# EasyEDA schematic SCH_XO-PAD_2026-07-20.json
TITLE: Sheet_1; REV: 1.0; Date: 2026-07-19; Sheet: 1/1; Drawn By: zumikoboi; Company: Your Company
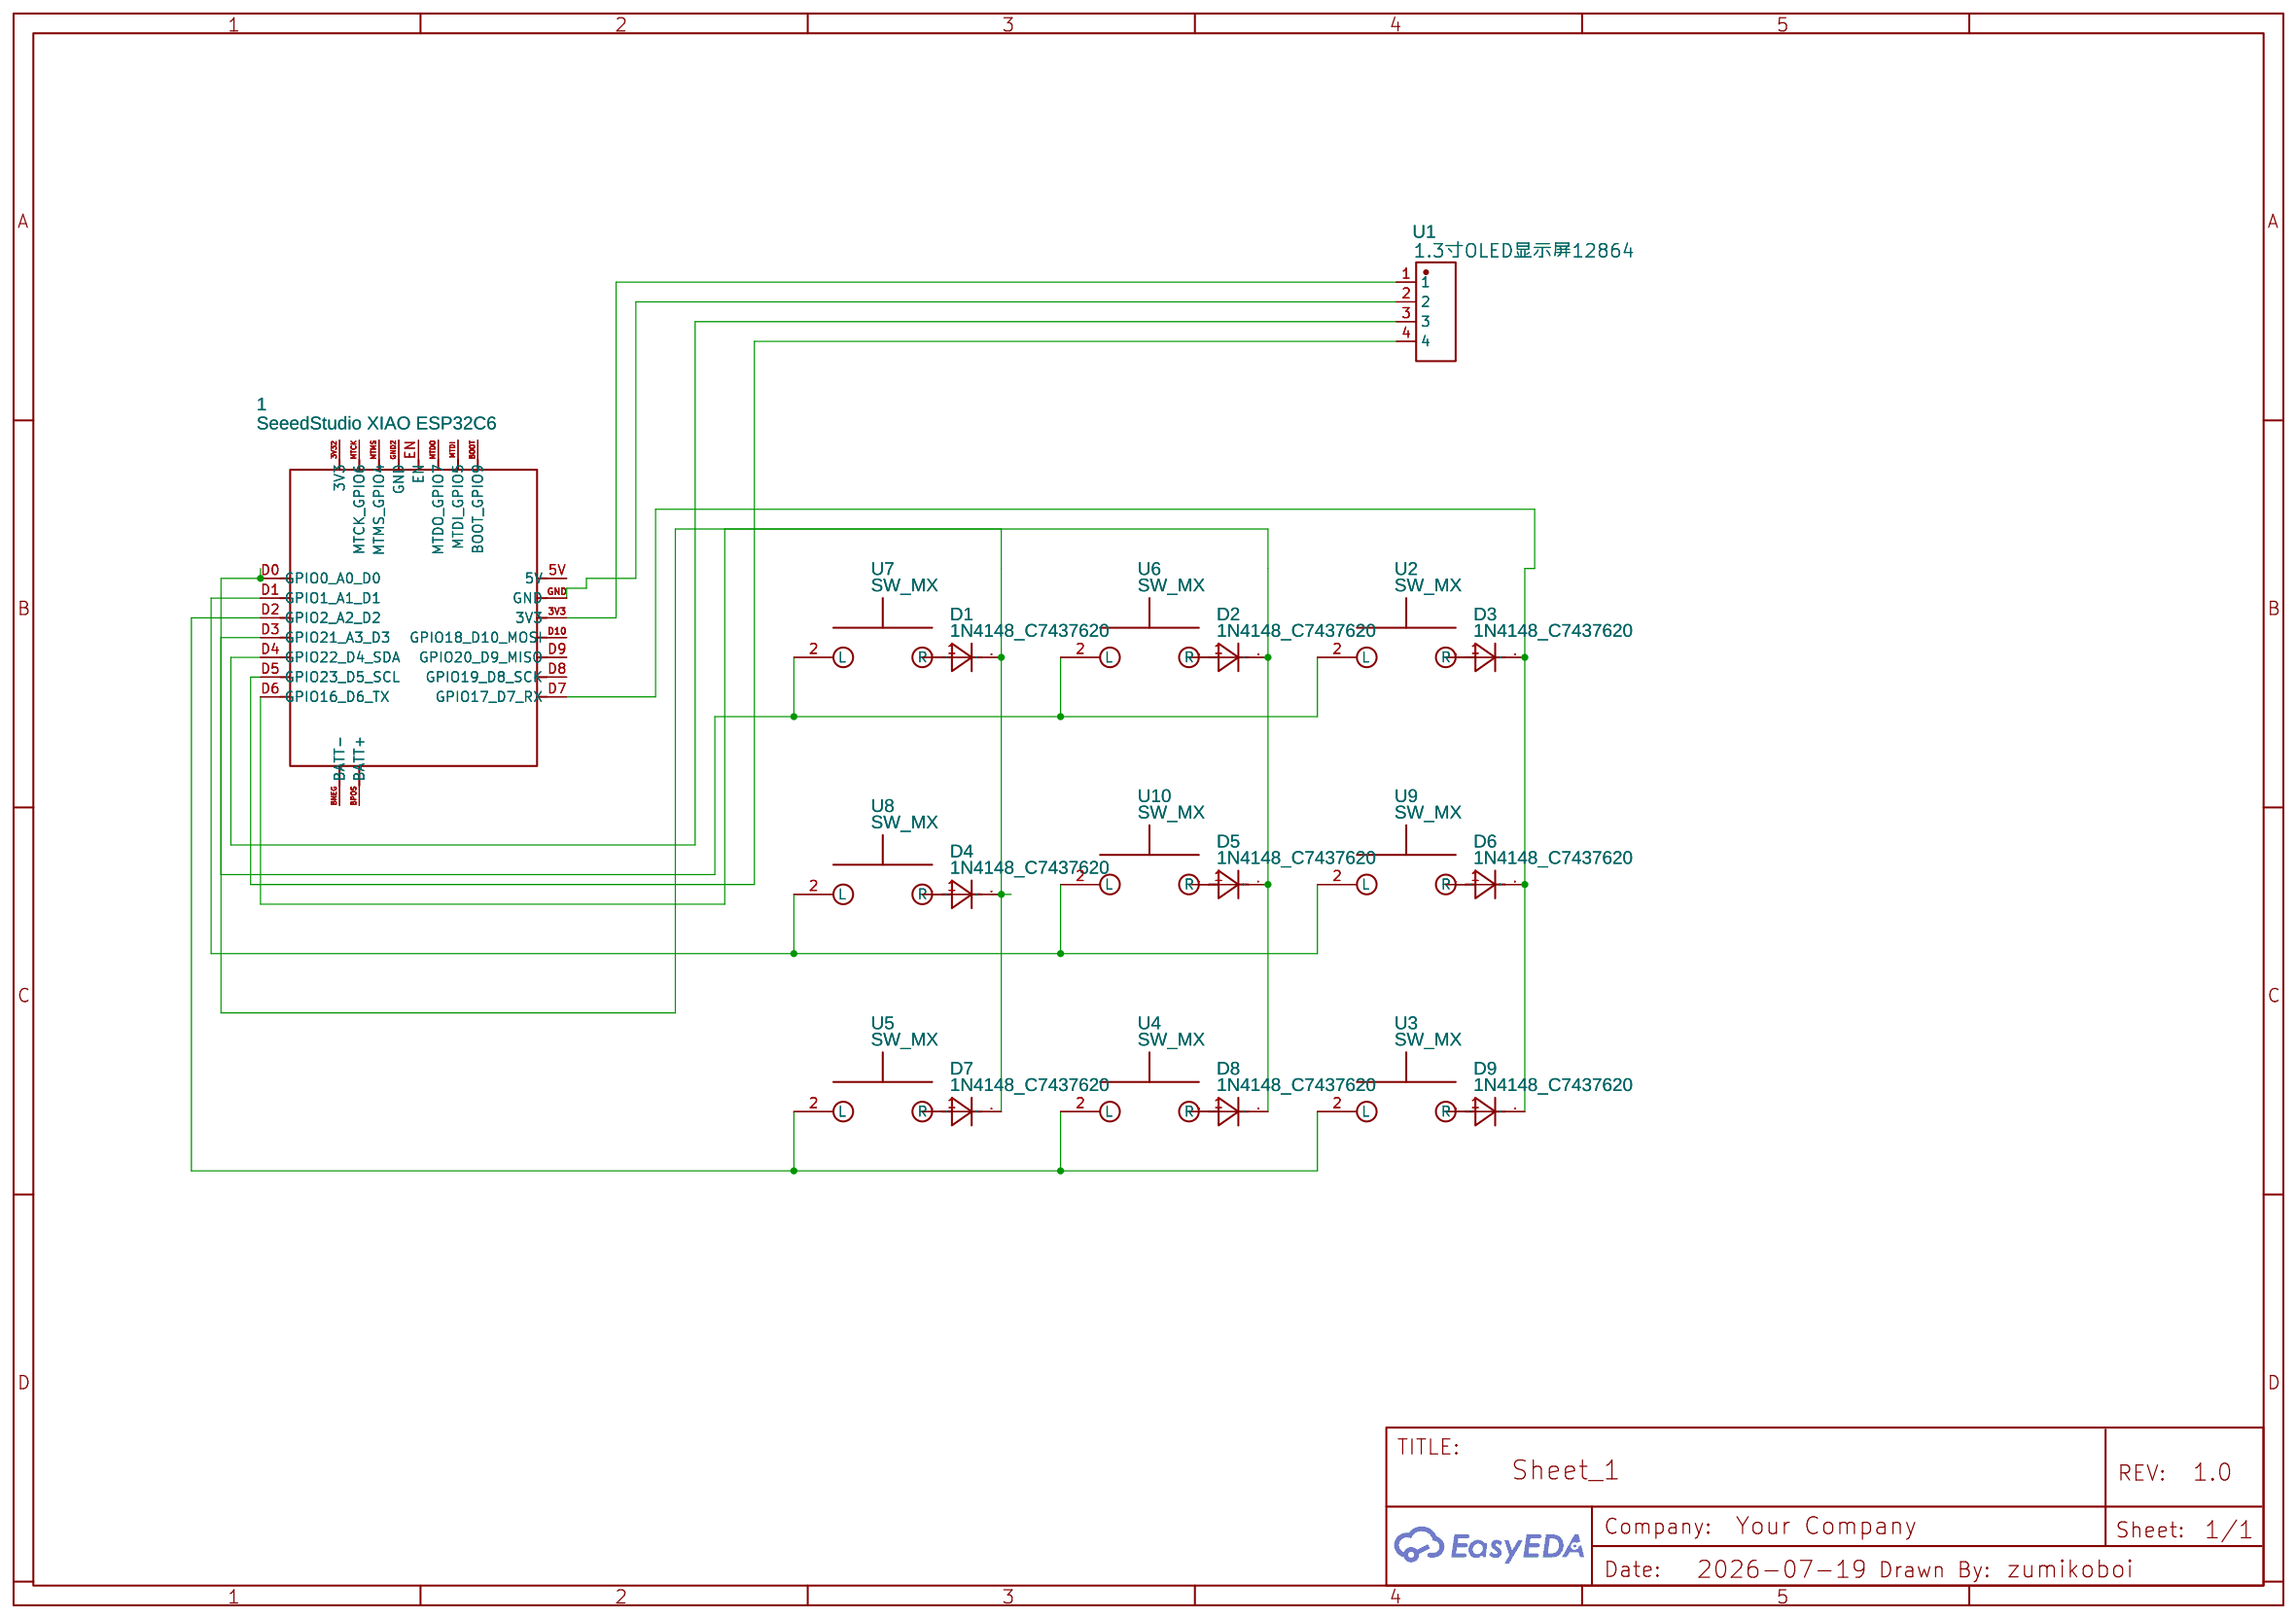
[diagram p0: schematic sheet]

## Parts
1  SeeedStudio XIAO ESP32C6  [SEEDSTUDIO XIAO ESP32C6]
D1  1N4148_C7437620  [DO-35_BD2.2-L4.0-D0.50_1N4148]
D2  1N4148_C7437620  [DO-35_BD2.2-L4.0-D0.50_1N4148]
D3  1N4148_C7437620  [DO-35_BD2.2-L4.0-D0.50_1N4148]
D4  1N4148_C7437620  [DO-35_BD2.2-L4.0-D0.50_1N4148]
D5  1N4148_C7437620  [DO-35_BD2.2-L4.0-D0.50_1N4148]
D6  1N4148_C7437620  [DO-35_BD2.2-L4.0-D0.50_1N4148]
D7  1N4148_C7437620  [DO-35_BD2.2-L4.0-D0.50_1N4148]
D8  1N4148_C7437620  [DO-35_BD2.2-L4.0-D0.50_1N4148]
D9  1N4148_C7437620  [DO-35_BD2.2-L4.0-D0.50_1N4148]
U1  1.3寸OLED显示屏12864  [OLED-TH12864]
U2  SW_MX  [SW_MX]
U3  SW_MX  [SW_MX]
U4  SW_MX  [SW_MX]
U5  SW_MX  [SW_MX]
U6  SW_MX  [SW_MX]
U7  SW_MX  [SW_MX]
U8  SW_MX  [SW_MX]
U9  SW_MX  [SW_MX]
U10  SW_MX  [SW_MX]

## Library data of the parts
1 = SeeedStudio XIAO ESP32C6: Contributor: williammarktaylor
D1-D9 = 1N4148_C7437620: Supplier: LCSC; Supplier Part: C7437620; Manufacturer: XCH(旭昌辉); Manufacturer Part: 1N4148; JLCPCB Part Class: Extended Part; Contributor: lcsc
U1 = 1.3寸OLED显示屏12864: Contributor: lcsc; Supplier: LCSC; Supplier Part: C9900014198; Manufacturer: null; JLCPCB Part Class: Extended Part
U2-U10 = SW_MX: Contributor: gianni2009

## Nets
Net-(1-3V3): 1.3V3 U1.1
Net-(1-D0): 1.D0(GPIO0_A0) U2.2(L) U6.2(L) U7.2(L)
Net-(1-D1): 1.D1(GPIO1_A1) U8.2(L) U9.2(L) U10.2(L)
Net-(1-D2): 1.D2(GPIO2_A2) U3.2(L) U4.2(L) U5.2(L)
Net-(1-D3): 1.D3(GPIO21_A3) D1.2(C) D4.2(C) D7.2(C)
Net-(1-D4): 1.D4(GPIO22_D4_SDA) U1.3
Net-(1-D5): 1.D5(GPIO23_D5_SCL) U1.4
Net-(1-D6): 1.D6(GPIO16_D6_TX) D2.2(C) D5.2(C) D8.2(C)
Net-(1-D7): 1.D7(GPIO17_D7_RX) D3.2(C) D6.2(C) D9.2(C)
Net-(1-GND): 1.GND U1.2

Not connected (* = marked no-connect by the designer): 1 3V32(3V3) 5V BNEG(BATT-) BOOT(BOOT_GPIO9) BPOS(BATT+) D8(GPIO19_D8_SCK) D9(GPIO20_D9_MISO) D10(GPIO18_D10_MOSI) EN GND2(GND) MTCK(MTCK_GPIO6) MTDI(MTDI_GPIO5) MTDO(MTDO_GPIO7) MTMS(MTMS_GPIO4); D1 1(A); D2 1(A); D3 1(A); D4 1(A); D5 1(A); D6 1(A); D7 1(A); D8 1(A); D9 1(A); U2 1(R); U3 1(R); U4 1(R); U5 1(R); U6 1(R); U7 1(R); U8 1(R); U9 1(R); U10 1(R)
